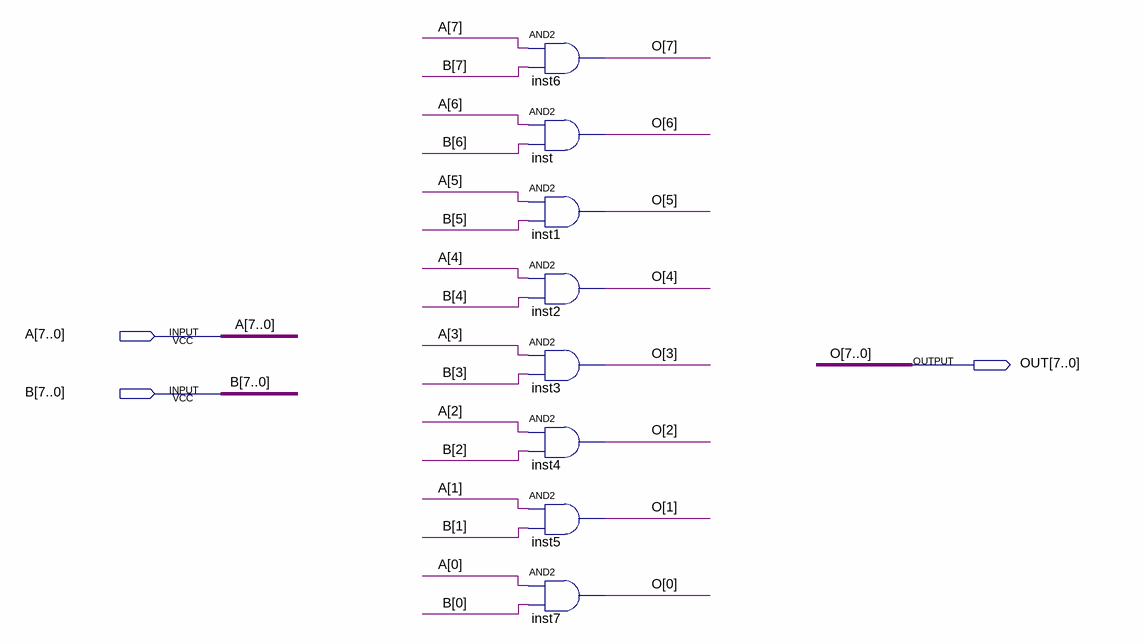
[diagram p0: schematic sheet]
// Quartus schematic AND_8BIT.bdf as structural Verilog: 8 symbols, 3 pins
module AND_8BIT (
  input  [7:0] A,
  input  [7:0] B,
  output [7:0] OUT
);

  and inst6 (OUT[7], A[7], B[7]);
  and inst (OUT[6], A[6], B[6]);
  and inst1 (OUT[5], A[5], B[5]);
  and inst2 (OUT[4], A[4], B[4]);
  and inst3 (OUT[3], A[3], B[3]);
  and inst4 (OUT[2], A[2], B[2]);
  and inst5 (OUT[1], A[1], B[1]);
  and inst7 (OUT[0], A[0], B[0]);

  // Other names for the same wires on the sheet: O[7:0] = OUT
endmodule
